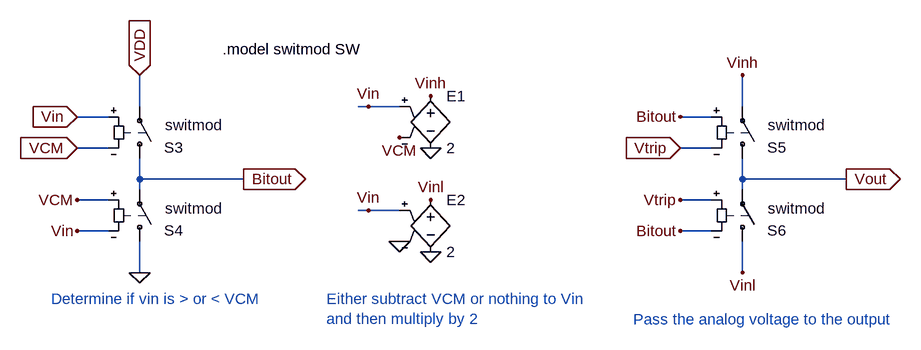
[diagram p0: schematic ADCbit.asc]
ADCbit.asc, the LTspice schematic file:
Version 4
SHEET 1 2740 696
WIRE 1088 -944 1040 -944
WIRE 1088 -896 1040 -896
WIRE 1088 -816 1040 -816
WIRE 1088 -768 1040 -768
WIRE 1136 -960 1136 -1008
WIRE 1136 -848 1136 -880
WIRE 1136 -832 1136 -848
WIRE 1136 -704 1136 -752
WIRE 1296 -848 1136 -848
WIRE 1488 -960 1472 -960
WIRE 1488 -800 1472 -800
WIRE 1536 -960 1488 -960
WIRE 1536 -800 1488 -800
WIRE 2016 -944 1968 -944
WIRE 2016 -896 1968 -896
WIRE 2016 -816 1968 -816
WIRE 2016 -768 1968 -768
WIRE 2064 -960 2064 -1008
WIRE 2064 -848 2064 -880
WIRE 2064 -832 2064 -848
WIRE 2064 -704 2064 -752
WIRE 2224 -848 2064 -848
FLAG 1040 -944 Vin
IOPIN 1040 -944 In
FLAG 1040 -896 VCM
IOPIN 1040 -896 In
FLAG 1040 -816 VCM
FLAG 1040 -768 Vin
FLAG 1296 -848 Bitout
IOPIN 1296 -848 Out
FLAG 1136 -704 0
FLAG 1136 -1008 VDD
IOPIN 1136 -1008 In
FLAG 1968 -944 Bitout
FLAG 1968 -896 Vtrip
IOPIN 1968 -896 In
FLAG 1968 -816 Vtrip
FLAG 1968 -768 Bitout
FLAG 2224 -848 Vout
IOPIN 2224 -848 Out
FLAG 1584 -896 0
FLAG 1584 -736 0
FLAG 1584 -976 Vinh
FLAG 1584 -816 Vinl
FLAG 1536 -752 0
FLAG 1536 -912 VCM
FLAG 1488 -960 Vin
FLAG 1488 -800 Vin
FLAG 2064 -1008 Vinh
FLAG 2064 -704 Vinl
SYMBOL sw 1136 -864 M180
WINDOW 3 24 -12 Left 0
WINDOW 38 39 67 Left 0
WINDOW 0 38 33 Left 0
SYMATTR Value ""
SYMATTR SpiceModel switmod
SYMATTR InstName S3
SYMBOL sw 1136 -736 M180
WINDOW 3 24 -12 Left 0
WINDOW 38 39 67 Left 0
WINDOW 0 38 33 Left 0
SYMATTR Value ""
SYMATTR SpiceModel switmod
SYMATTR InstName S4
SYMBOL sw 2064 -864 M180
WINDOW 3 24 -12 Left 0
WINDOW 38 39 67 Left 0
WINDOW 0 38 33 Left 0
SYMATTR Value ""
SYMATTR SpiceModel switmod
SYMATTR InstName S5
SYMBOL sw 2064 -736 M180
WINDOW 3 24 -12 Left 0
WINDOW 38 39 67 Left 0
WINDOW 0 38 33 Left 0
SYMATTR Value ""
SYMATTR SpiceModel switmod
SYMATTR InstName S6
SYMBOL e 1584 -992 R0
SYMATTR InstName E1
SYMATTR Value 2
SYMBOL e 1584 -832 R0
SYMATTR InstName E2
SYMATTR Value 2
TEXT 1000 -664 Left 0 ;Determine if vin is > or < VCM
TEXT 1424 -664 Left 0 ;Either subtract VCM or nothing to Vin\nand then multiply by 2
TEXT 1896 -632 Left 0 ;Pass the analog voltage to the output
TEXT 1264 -1048 Left 0 !.model switmod SW

The netlist it stands for:
* ADCbit.asc
S3 Bitout VDD Vin VCM switmod
S4 0 Bitout VCM Vin switmod
S5 Vout Vinh Bitout Vtrip switmod
S6 Vinl Vout Vtrip Bitout switmod
E1 Vinh 0 Vin VCM 2
E2 Vinl 0 Vin 0 2
* Determine if vin is > or < VCM
* Either subtract VCM or nothing to Vin
* and then multiply by 2
* Pass the analog voltage to the output
.model switmod SW
.backanno
.end